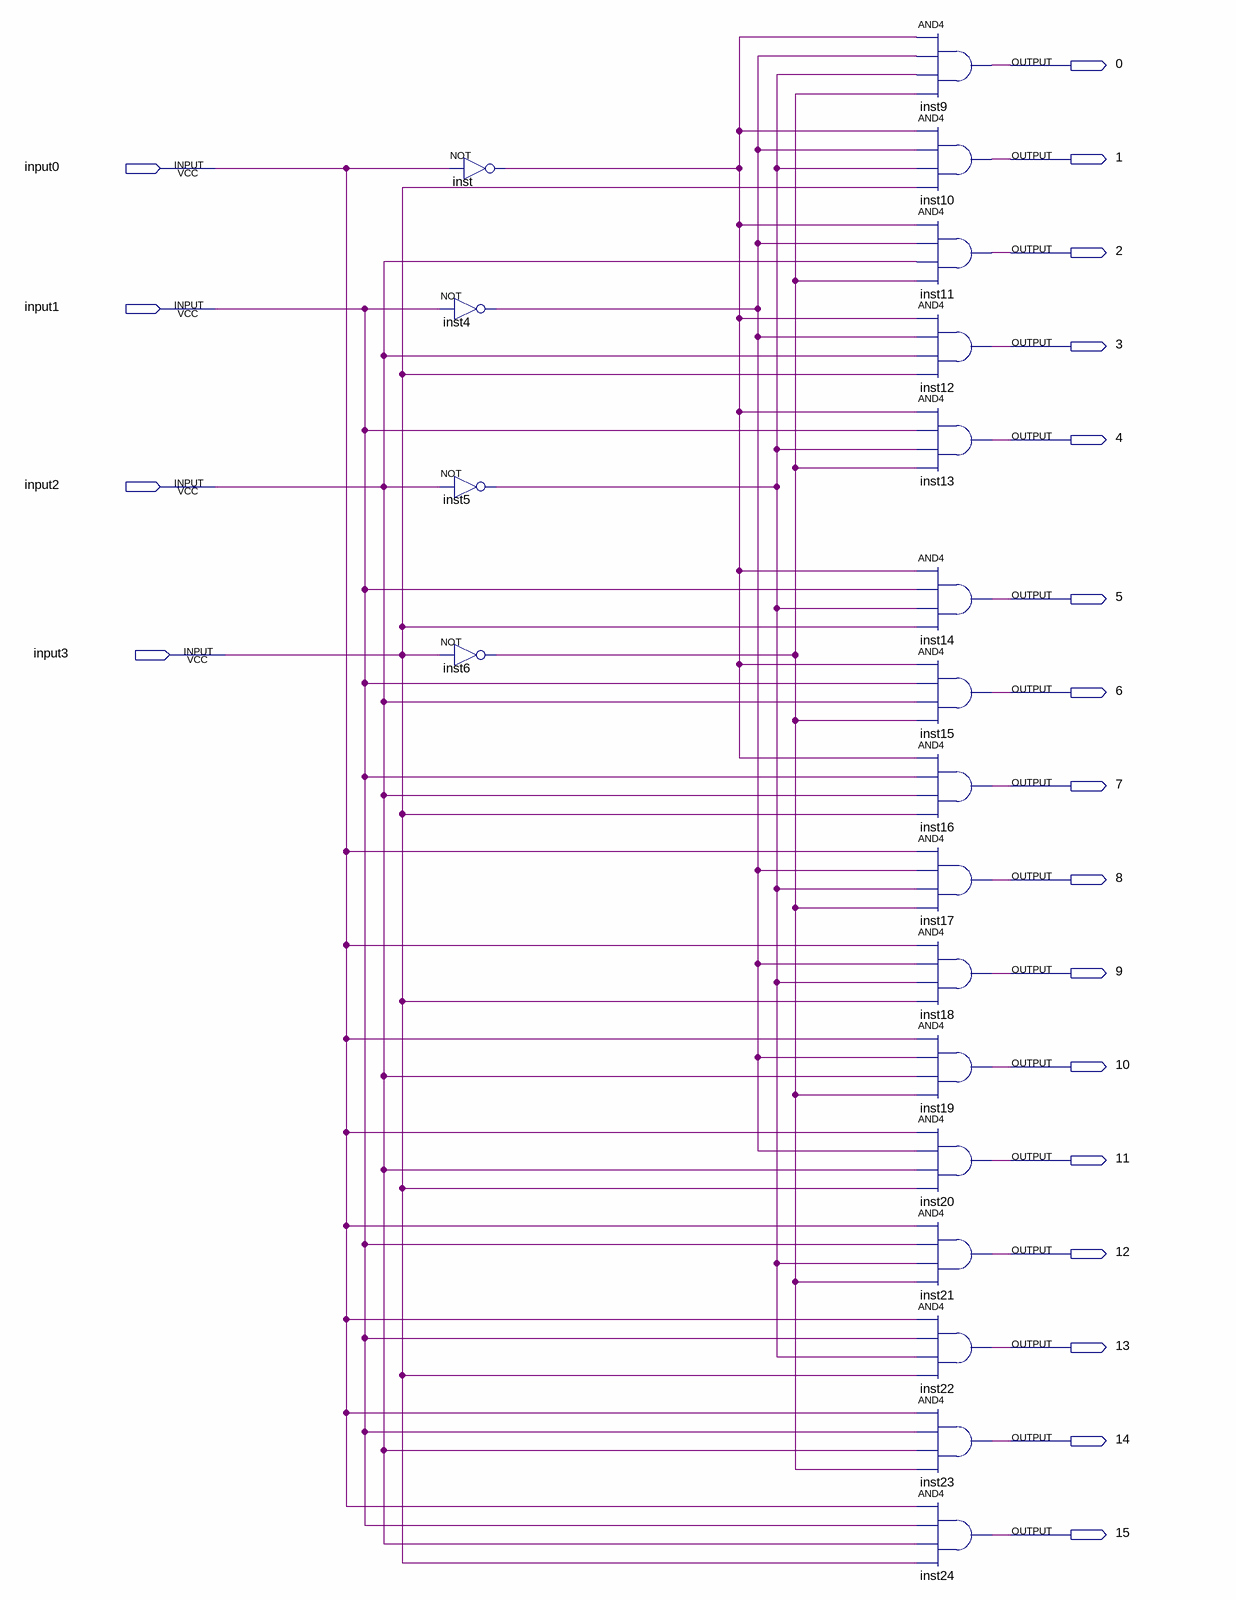
[diagram p0: schematic sheet]
// Quartus schematic 416DECODER.bdf as structural Verilog: 20 symbols, 20 pins
module \416DECODER  (
  input  input0,
  input  input1,
  input  input2,
  input  input3,
  output \0 ,
  output \1 ,
  output \2 ,
  output \3 ,
  output \4 ,
  output \5 ,
  output \6 ,
  output \7 ,
  output \8 ,
  output \9 ,
  output \10 ,
  output \11 ,
  output \12 ,
  output \13 ,
  output \14 ,
  output \15 
);

  wire inst4_out, inst5_out, inst6_out, inst_out;

  not inst (inst_out, input0);
  not inst4 (inst4_out, input1);
  not inst5 (inst5_out, input2);
  not inst6 (inst6_out, input3);
  and inst9 (\0 , inst_out, inst4_out, inst5_out, inst6_out);
  and inst10 (\1 , inst_out, inst4_out, inst5_out, input3);
  and inst11 (\2 , inst_out, inst4_out, input2, inst6_out);
  and inst12 (\3 , inst_out, inst4_out, input2, input3);
  and inst13 (\4 , inst_out, input1, inst5_out, inst6_out);
  and inst14 (\5 , inst_out, input1, inst5_out, input3);
  and inst15 (\6 , inst_out, input1, input2, inst6_out);
  and inst16 (\7 , inst_out, input1, input2, input3);
  and inst17 (\8 , input0, inst4_out, inst5_out, inst6_out);
  and inst18 (\9 , input0, inst4_out, inst5_out, input3);
  and inst19 (\10 , input0, inst4_out, input2, inst6_out);
  and inst20 (\11 , input0, inst4_out, input2, input3);
  and inst21 (\12 , input0, input1, inst5_out, inst6_out);
  and inst22 (\13 , input0, input1, inst5_out, input3);
  and inst23 (\14 , input0, input1, input2, inst6_out);
  and inst24 (\15 , input0, input1, input2, input3);
endmodule
